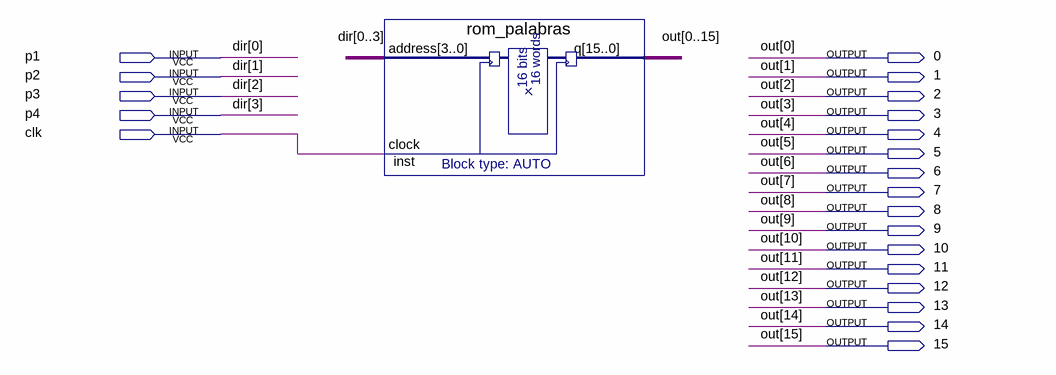
[diagram p0: schematic sheet]
// Quartus schematic bin_palabra.bdf as structural Verilog: 1 symbols, 21 pins
module bin_palabra (
  input  p1,
  input  p2,
  input  p3,
  input  p4,
  input  clk,
  output \0 ,
  output \1 ,
  output \2 ,
  output \3 ,
  output \4 ,
  output \5 ,
  output \6 ,
  output \7 ,
  output \8 ,
  output \9 ,
  output \10 ,
  output \11 ,
  output \12 ,
  output \13 ,
  output \14 ,
  output \15 
);

  rom_palabras inst (
    .address({p1, p2, p3, p4}), .clock(clk),
    .q({\0 , \1 , \2 , \3 , \4 , \5 , \6 , \7 , \8 , \9 , \10 , \11 , \12 , \13 , \14 , \15 }));

  // Other names for the same wires on the sheet: dir[3:0] = {p4, p3, p2, p1};
  //   out[15:0] = {\15 , \14 , \13 , \12 , \11 , \10 , \9 , \8 , \7 , \6 , \5 , \4 , \3 , \2 , \1 , \0 }
endmodule
